# EasyEDA Pro project motor_driver.eprj

# Schematic Schematic1

## Sheets
1 P1: Create Date: 2024-08-04; Page Name: P1; Project Name: motor_driver; Schematic Name: Schematic1; Update Date: 2024-08-15; Company: 嘉立创EDA; Page Size: A4; Version: V1.0
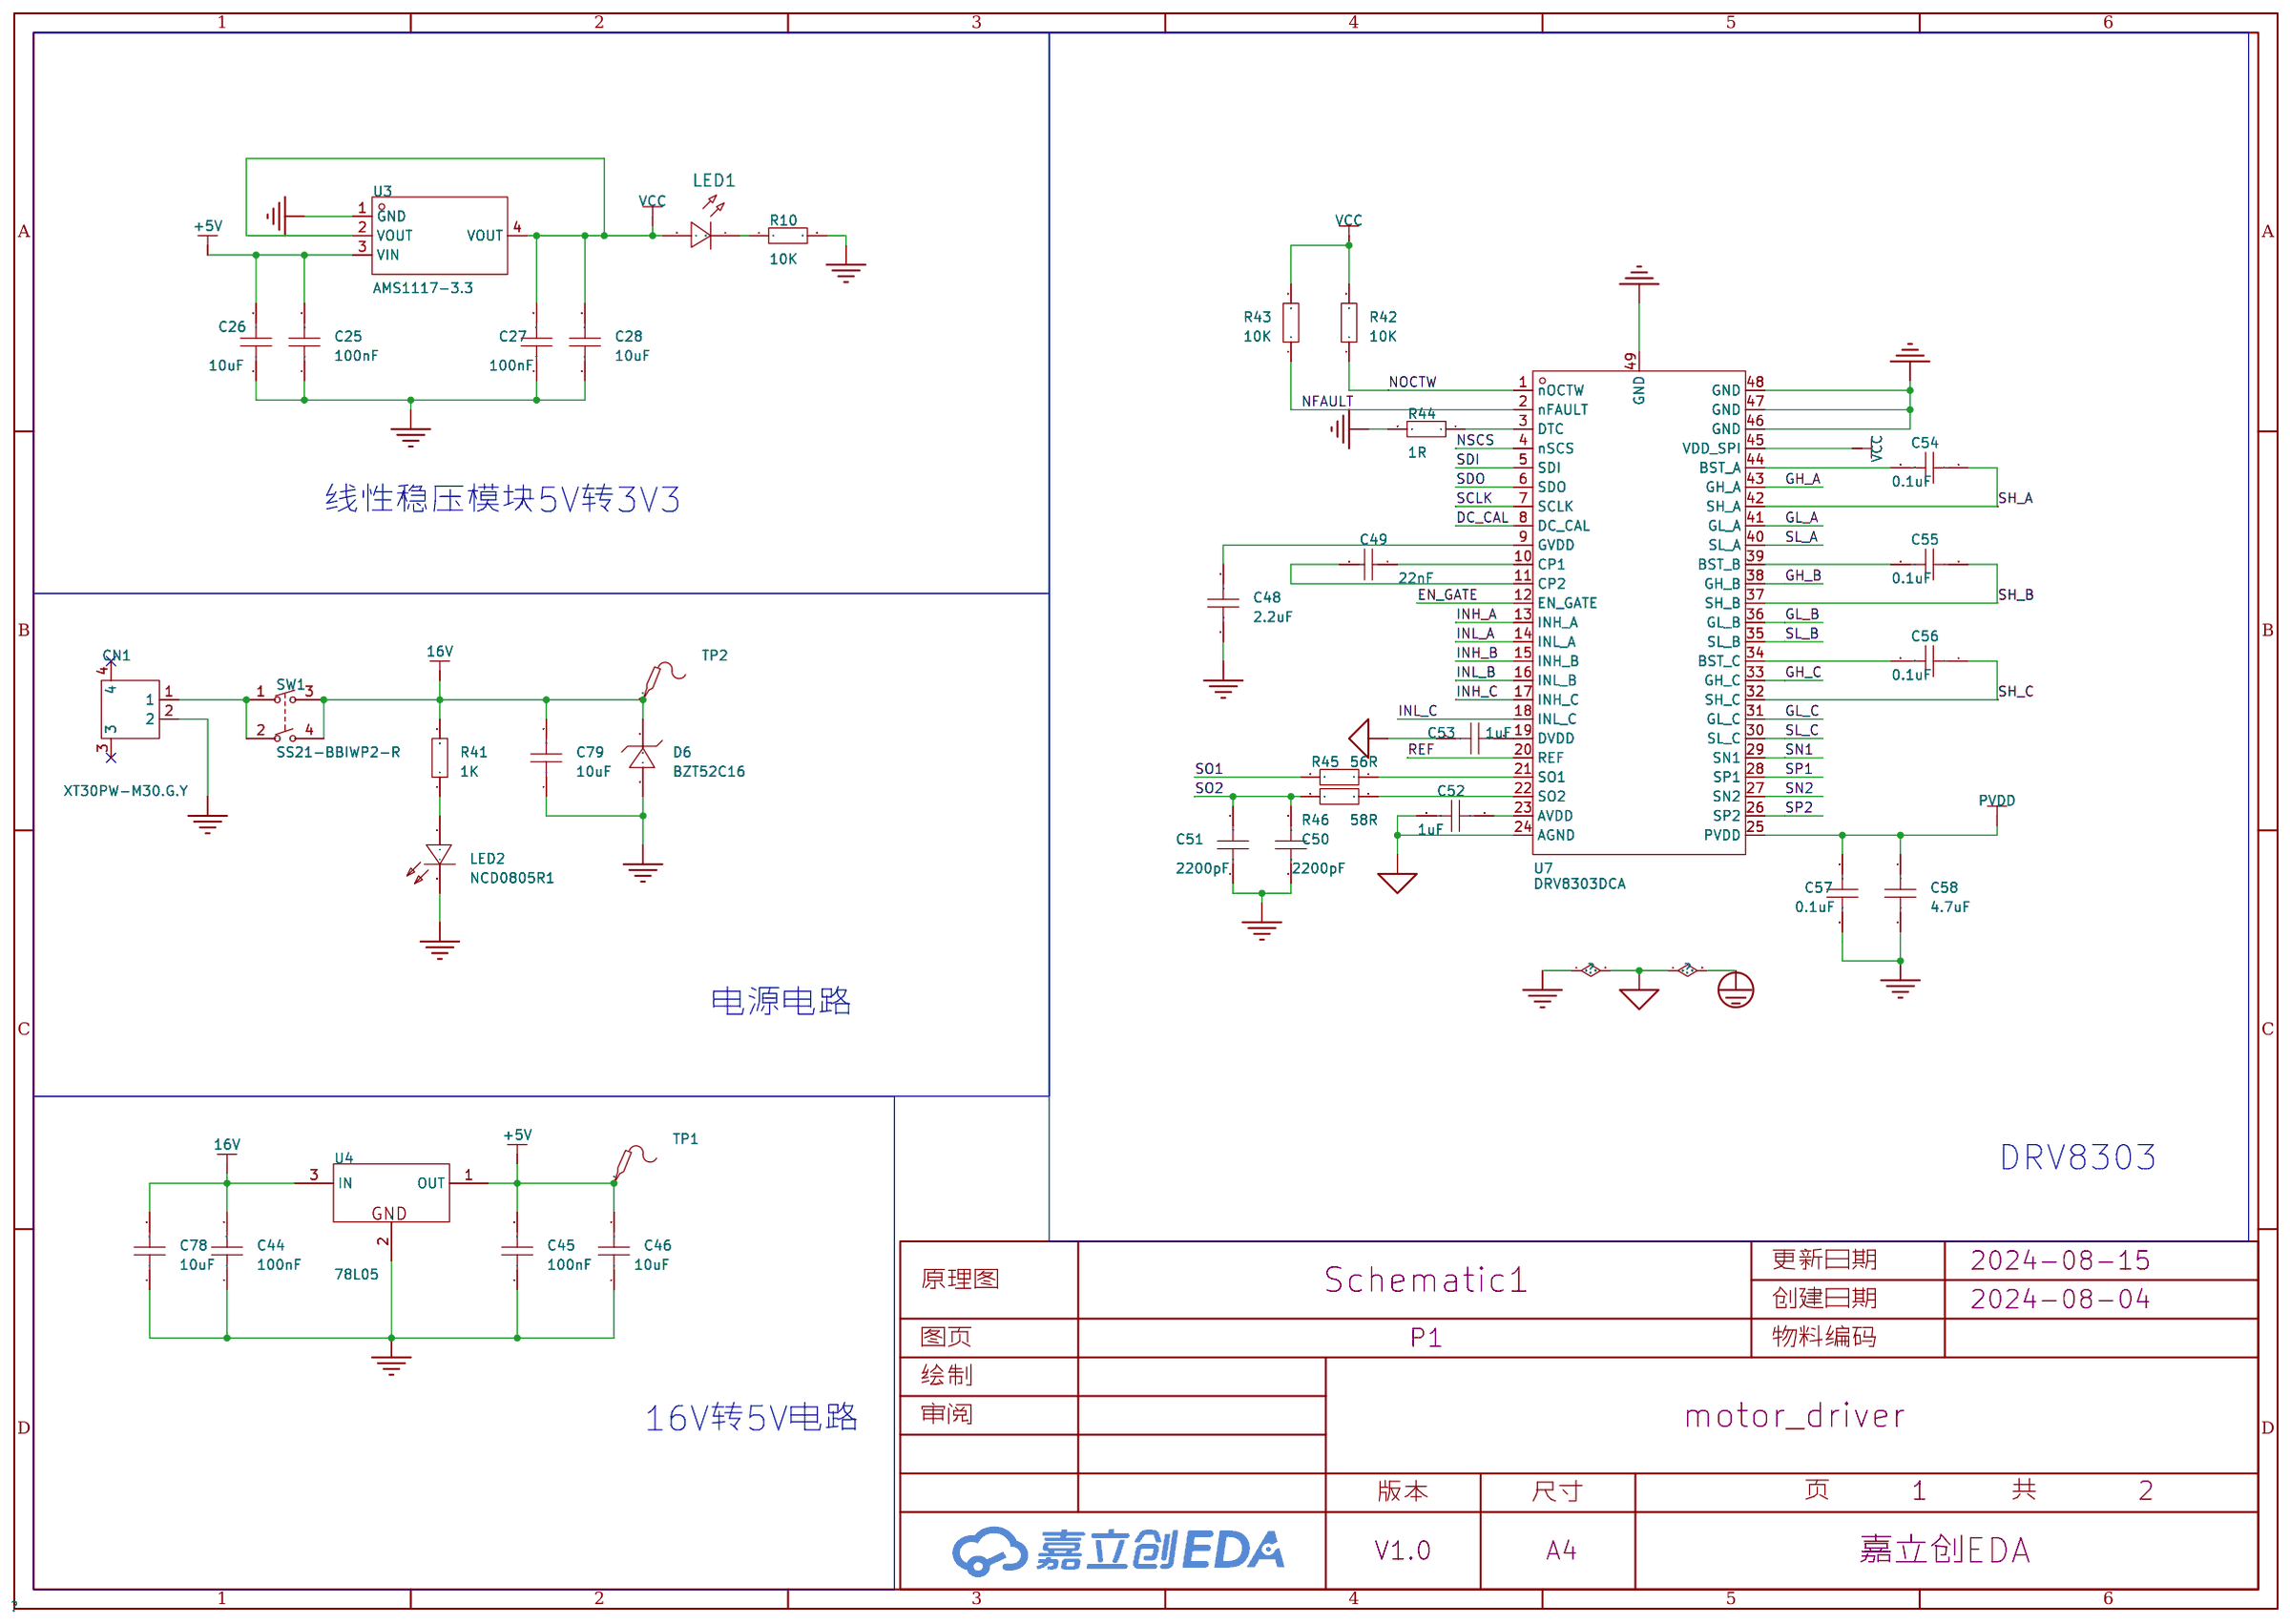
[diagram p0: P1]
2 P2: Page Name: P2; Update Date: 2024-08-27
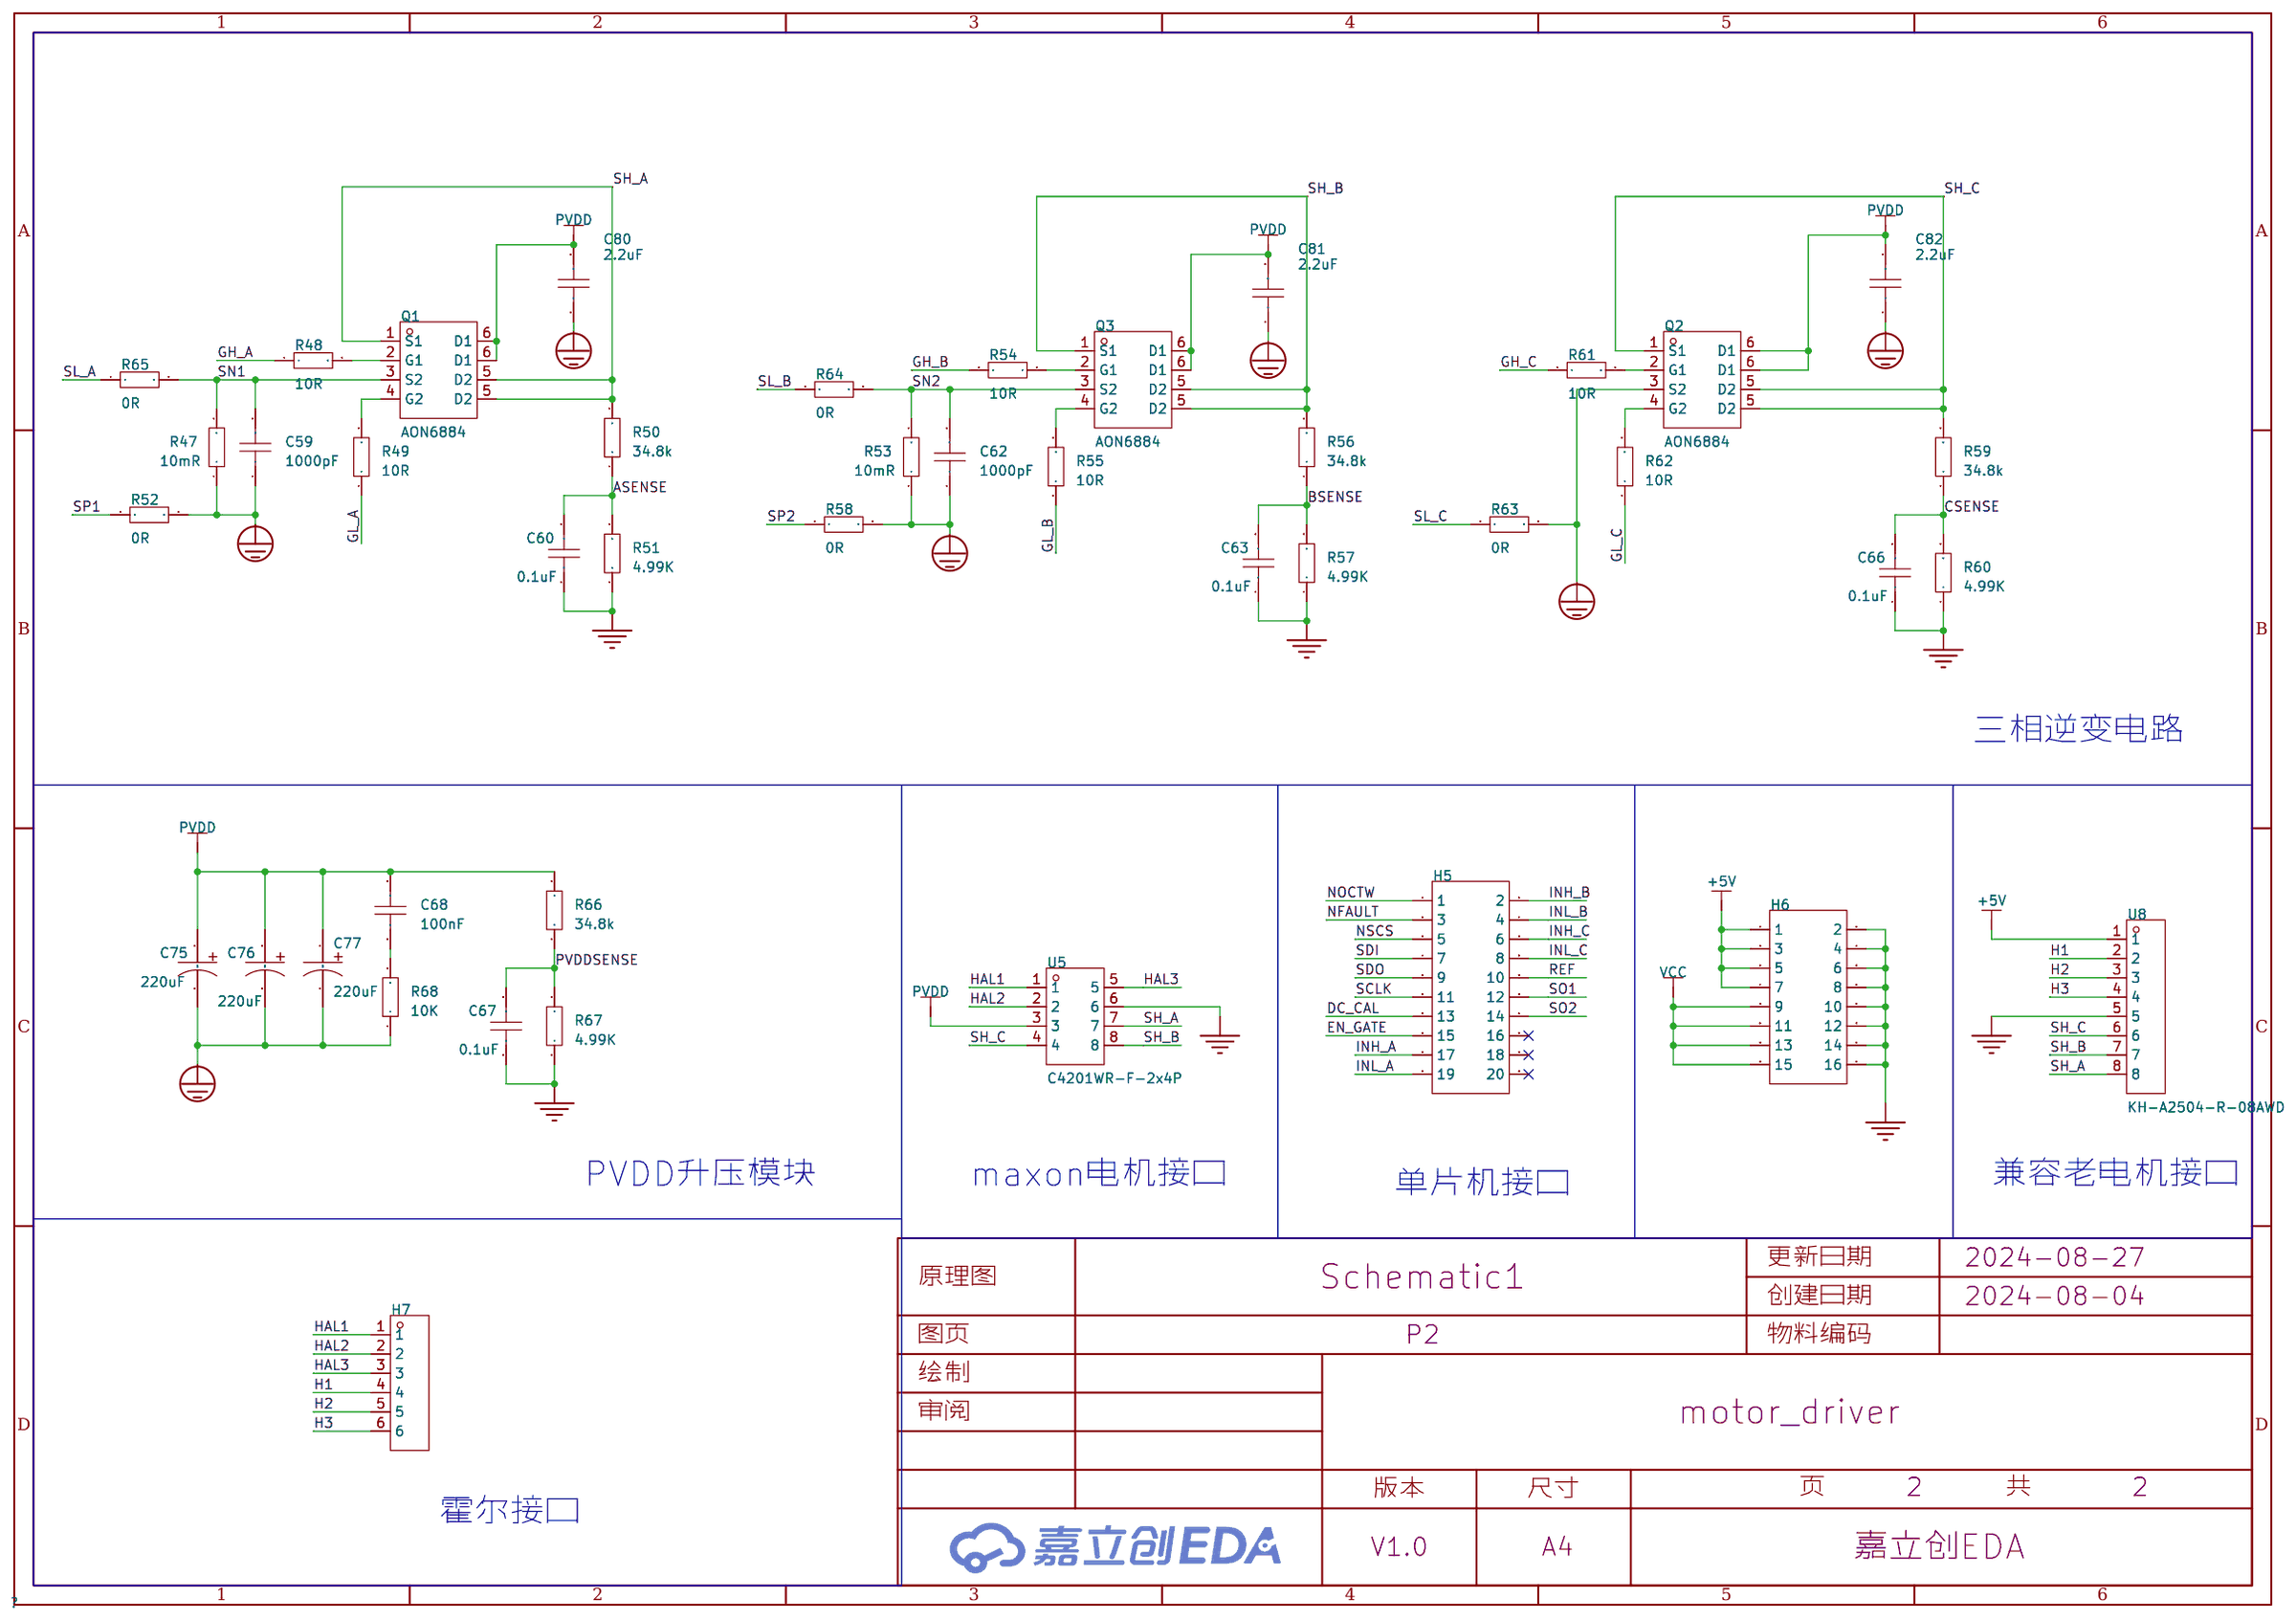
[diagram p1: P2]

## Parts
sheet P1
C25  100nF  [C0805]
C26  10uF  [C0805]
C27  100nF  [C0805]
C28  10uF  [C0805]
C44  100nF  [C0805]
C45  100nF  [C0805]
C46  10uF  [C0805]
C48  2.2uF  [C0805]
C49  22nF  [C0603]
C50  2200pF  [C0805]
C51  2200pF  [C0805]
C52  1uF  [C0805]
C53  1uF  [C0805]
C54  0.1uF  [C0805]
C55  0.1uF  [C0805]
C56  0.1uF  [C0805]
C57  0.1uF  [C0805]
C58  4.7uF  [C0805]
C78  10uF  [C0805]
C79  10uF  [C0805]
CN1  XT30PW-M30.G.Y  [CONN-TH_XT30PW-M]
D6  BZT52C16  [SOD-123_L2.7-W1.6-LS3.7-RD]
LED1  -  [LED_0805]
LED2  NCD0805R1  [LED0805-R-RD]
R10  10K  [R0805]
R41  1K  [R0603]
R42  10K  [R0603]
R43  10K  [R0603]
R44  1R  [R0603]
R45  56R  [R0603]
R46  58R  [R0603]
SW1  SS21-BBIWP2-R  [SW-TH_SS21-BBIWP2]
TP1  -  [Test-Point-0.5mm]
TP2  -  [Test-Point-0.5mm]
U3  AMS1117-3.3  [SOT-223-3_L6.5-W3.4-P2.30-LS7.0-BR]
U4  78L05  [SOT-89-3_L4.5-W2.5-P1.50-LS4.2-BR]
U7  DRV8303DCA  [HTSSOP-48_L12.5-W6.1-P0.50-LS8.1-BL-EP4.4]
sheet P2
C59  1000pF  [C0805]
C60  0.1uF  [C0603]
C62  1000pF  [C0805]
C63  0.1uF  [C0603]
C66  0.1uF  [C0603]
C67  0.1uF  [C0603]
C68  100nF  [C0805]
C75  220uF  [CAP-SMD_BD8.0-L8.3-W8.3-FD]
C76  220uF  [CAP-SMD_BD8.0-L8.3-W8.3-FD]
C77  220uF  [CAP-SMD_BD8.0-L8.3-W8.3-FD]
C80  2.2uF  [C0805]
C81  2.2uF  [C0805]
C82  2.2uF  [C0805]
H5  -  [HDR-TH_20P-P2.54-V-R2-C10-S2.54]
H6  -  [HDR-TH_16P-P2.54-V-F-R2-C8-S2.54-1]
H7  -  [HDR-TH_6P-P2.54-V-F]
Q1  AON6884  [DFN-8_L5.5-W5.2-P1.27-LS6.0-BL-EP2]
Q2  AON6884  [DFN-8_L5.5-W5.2-P1.27-LS6.0-BL-EP2]
Q3  AON6884  [DFN-8_L5.5-W5.2-P1.27-LS6.0-BL-EP2]
R47  10mR  [R0603]
R48  10R  [R0603]
R49  10R  [R0603]
R50  34.8k  [R0603]
R51  4.99K  [R0603]
R52  0R  [R0603]
R53  10mR  [R0603]
R54  10R  [R0603]
R55  10R  [R0603]
R56  34.8k  [R0603]
R57  4.99K  [R0603]
R58  0R  [R0603]
R59  34.8k  [R0603]
R60  4.99K  [R0603]
R61  10R  [R0603]
R62  10R  [R0603]
R63  0R  [R0603]
R64  0R  [R0603]
R65  0R  [R0603]
R66  34.8k  [R0603]
R67  4.99K  [R0603]
R68  10K  [R0603]
U5  C4201WR-F-2x4P  [CONN-TH_C4201WR-F-2X4P]
U8  KH-A2504-R-08AWD  [CONN-TH_8P-P2.50_KH-A2504-R-08AWD]

## Library data of the parts
C25-C28 C44-C46 C48 C50-C59 C62 C68 = CAP_0805: Supplier Footprint: 0805
C49 = CL10B223KB8NNNC: 容值:22nF;精度:±10%;额定电压:50V;材质(温度系数):X7R;; LCSC Part Name: 22nF ±10% 50V; Supplier Part: C21122; Manufacturer: SAMSUNG(三星); Supplier Footprint: 0603; JLCPCB Part Class: 基础库; Datasheet: https://atta.szlcsc.com/upload/public/pdf/source/20160218/1457707763339.pdf; Supplier: LCSC; Tolerance: ±10%; Voltage Rated: 50V; Temperature Coefficient: X7R
C78 C79 = CL21A106KAYNNNE_C15850: 容值:10uF;精度:±10%;额定电压:25V;材质(温度系数):X5R;; LCSC Part Name: 10uF ±10% 25V; Supplier Part: C15850; Manufacturer: SAMSUNG(三星); Manufacturer Part: CL21A106KAYNNNE; Supplier Footprint: 0805; JLCPCB Part Class: 基础库; Datasheet: https://atta.szlcsc.com/upload/public/pdf/source/20160218/1457707763339.pdf; Supplier: LCSC; Tolerance: ±10%; Voltage Rated: 25V; Temperature Coefficient: X5R
CN1 = XT30PW-M30.G.Y: 类别:-;类型1:-;; LCSC Part Name: AMASS(艾迈斯)航模插头 卧式弯脚 XT30PW-M公头; Supplier Part: C431092; Manufacturer: AMASS(艾迈斯); JLCPCB Part Class: Extended Part; Datasheet: https://atta.szlcsc.com/upload/public/pdf/source/20220222/6A9F22F7850E25B33E1BE430ADF8560B.pdf; Supplier: LCSC; Type: 航模插头; RatedVoltage: DC 500V; InterfaceType: 公头; RatedCurrent: 15A; RecommendedWireGauge: 16/18/20AWG; contact resistance: 1.2mΩ; specifications: 2pin
D6 = BZT52C16_C216724: 二极管配置:独立式;稳压值(标称值):16V;稳压值(范围):15.3V~17.1V;功率:500mW;精度:±5%;; Supplier Part: C216724; Manufacturer: SHIKUES(时科); Supplier Footprint: SOD-123; JLCPCB Part Class: 扩展库; Datasheet: https://atta.szlcsc.com/upload/public/pdf/source/20180521/C216736_0F7817A5B0D519AB82EE72E876335F07.pdf; Supplier: LCSC; Diode Configuration: 独立式; Zener Voltage (Nom): 16V; Reverse Leakage Current (Ir): 100nA@12V; Zener Voltage (Range): 15.3V~17.1V; Power Dissipation: 500mW; Zener Impedance (Zzt): 40Ω; Tolerance: ±5%
LED1 = LED_0805-R: Supplier Footprint: 0805
LED2 = NCD0805R1: 灯头类型:-;发光颜色:红色;正向电压(VF):1.6V~2.6V;功率:65mW;正向电流:20mA;主波长:615nm~630nm;二极管配置:独立二极管;透镜颜色:无色透明透镜;色温:-;发光强度:67mcd~195mcd;发光角度:130°;载带方式:-;工作温度:-30℃~+85℃;; Supplier Part: C84256; Manufacturer: 国星光电; Supplier Footprint: 0805; JLCPCB Part Class: 基础库; Datasheet: https://atta.szlcsc.com/upload/public/pdf/source/20200820/C84256_F0A75A43B3EAD75808600A0514C76B99.pdf; Supplier: LCSC; Emitted Color: 红色; Forward Voltage (VF): 1.6V~2.6V; Power Dissipation: 65mW; Forward Current: 20mA; Dominant Wavelength: 615nm~630nm; Diode Configuration: 独立二极管; Lens Color: 无色透明透镜; Luminous Intensity: 67mcd~195mcd; Viewing Angle: 130°; Operating Temperature: -30℃~+85℃
R10 = Res_0805: Supplier Footprint: 0805
R41-R68 = Res_0603: Supplier Footprint: 0603
SW1 = SS21-BBIWP2-R: 带灯:-;引脚样式:焊片;额定电流:10A;额定电压(AC):250V;额定电压(DC):-;电路结构:双刀单掷;机械寿命:-;; LCSC Part Name: 跷板开关DPST 15x21mm; Supplier Part: C309182; Manufacturer: Legion(六钧); Supplier Footprint: 插件; JLCPCB Part Class: 扩展库; Datasheet: https://atta.szlcsc.com/upload/public/pdf/source/20190311/C309182_BE3155CDE2291F8D537E9264D9294CC5.pdf; Supplier: LCSC; Actuator Type: 凹面弯曲; Pin Style: 焊片; Actuator Color: 黑色; Contact Current: 10A; Voltage Rating (AC): 250V; Circuit: 双刀单掷; Actuator Identifier: - O
TP1 TP2 = Test-Point: Test Point 测试点
U3 = AMS1117-3.3_C6186: 输出类型:固定;最大输入电压:-;输出电压:3.3V;最大输出电流:1A;电源纹波抑制比(PSRR):72dB@(120Hz);输出极性:正极;; LCSC Part Name: 输出3.3V 1A; Supplier Part: C6186; Manufacturer: AMS; Supplier Footprint: SOT-223; JLCPCB Part Class: 基础库; Datasheet: https://atta.szlcsc.com/upload/public/pdf/source/20180727/C6186_7A095716F0823C02F1997A905E26C086.pdf; Supplier: LCSC; Output Type: 固定; Output Voltage: 3.3V; MAX Output Current: 1A; Power Supply Rejection Ratio (PSRR): 72dB@(120Hz); Dropout Voltage: 1.3V@(800mA); Output Polarity: 正极; Number of Outputs: 1
U4 = 78L05_C347258: 输出类型:固定;最大输入电压:30V;输出电压:5V;最大输出电流:100mA;电源纹波抑制比(PSRR):49dB@(120Hz);输出极性:正极;; LCSC Part Name: 输入30V 输出5V 100mA; Supplier Part: C347258; Manufacturer: UMW(友台半导体); Supplier Footprint: SOT-89-3; JLCPCB Part Class: 扩展库; Datasheet: https://atta.szlcsc.com/upload/public/pdf/source/20231109/E3DE607B64FB2BED1580456949804217.pdf; Supplier: LCSC; Output Type: 固定; Maximum Input Voltage: 30V; Output Voltage: 5V; MAX Output Current: 100mA; Power Supply Rejection Ratio (PSRR): 49dB@(120Hz); Dropout Voltage: 1.7V@(40mA); standby current: 5.5mA; Operating Temperature: -20℃~+120℃@(Tj); Output Polarity: 正极; Number of Outputs: 1
U7 = DRV8303DCA: DRV8303 具有电流分流放大器和 SPI 的最大 65V 三相栅极驱动器; LCSC Part Name: 无刷直流BLDC电机驱动芯片 60V; Supplier Part: C1523892; Manufacturer: TI(德州仪器); Supplier Footprint: HTSSOP-48-EP-6.1mm; JLCPCB Part Class: 扩展库; Datasheet: https://www.ti.com/cn/lit/gpn/drv8303; Supplier: LCSC
C60 C63 C66 C67 = CAP_0603: Supplier Footprint: 0603
C75-C77 = 20SVPK220M: 容值:220uF;精度:±20%;额定电压:20V;纹波电流:1.01A@100kHz;等效串联电阻:25mΩ@100kHz~300kHz;类型:聚合物;; LCSC Part Name: 220uF ±20% 20V; Supplier Part: C454650; Manufacturer: PANASONIC(松下); Supplier Footprint: SMD,D8xL6.9mm; JLCPCB Part Class: 扩展库; Supplier: LCSC; Tolerance: ±20%; Rated Voltage: 20V; Ripple Current: 1.01A@100kHz; Equivalent Series Resistance(ESR): 25mΩ@100kHz~300kHz; Type: 聚合物; φD: 8mm; L: 6.9mm; Lifetime @ Temp: 100hrs@125℃; Operating Temperature: -55℃~+125℃
C80-C82 = CL21A225KBQNNNE: 容值:2.2uF;精度:±10%;额定电压:50V;材质(温度系数):X5R;; LCSC Part Name: 2.2uF ±10% 50V; Supplier Part: C377773; Manufacturer: SAMSUNG(三星); Supplier Footprint: 0805; JLCPCB Part Class: 基础库; Datasheet: https://atta.szlcsc.com/upload/public/pdf/source/20160218/1457707763339.pdf; Supplier: LCSC; Tolerance: ±10%; Voltage Rated: 50V; Temperature Coefficient: X5R
H5 = HDR-F_2.54_2x10: Supplier Part: C30867; Supplier Footprint: 插件
H6 = HDR-F_2.54_2x8: Supplier Part: C30734; Supplier Footprint: 插件
H7 = HDR-F_2.54_1x6P: Supplier Part: C40877; Supplier Footprint: 插件
Q1-Q3 = AON6884: 类型:2个N沟道;漏源电压(Vdss):40V;连续漏极电流(Id):9A;功率(Pd):1.6W;导通电阻(RDS(on)@Vgs,Id):11.3mΩ@10V,10A;阈值电压(Vgs(th)@Id):2.7V@250uA;; LCSC Part Name: 2个N沟道 耐压:40V 电流:9A; Supplier Part: C125872; Manufacturer: AOS; Supplier Footprint: DFN-8(5.2x5.5); JLCPCB Part Class: 扩展库; Datasheet: https://atta.szlcsc.com/upload/public/pdf/source/20180326/C125872_34AF0DD57D8DED273B86A053347F87CE.pdf; Supplier: LCSC; Type: 2个N沟道; Drain Source Voltage (Vdss): 40V; Continuous Drain Current (Id): 9A; Power Dissipation (Pd): 1.6W; Drain Source On Resistance (RDS(on)@Vgs,Id): 11.3mΩ@10V,10A; Gate Threshold Voltage (Vgs(th)@Id): 2.7V@250uA
U5 = C4201WR-F-2x4P_C5333426: Supplier Part: C5333426; Manufacturer: CJT(长江连接器); Supplier Footprint: 弯插,P=4.2mm; JLCPCB Part Class: 扩展库; Datasheet: https://atta.szlcsc.com/upload/public/pdf/source/20210326/C2764355_A41BE8F3AF9C3DD861E3A84F228C93DC.pdf; Supplier: LCSC
U8 = KH-A2504-R-08AWD: 插针结构:1x8P;间距:2.54mm;安装方式:弯插;总PIN数:8P;排数:1;每排PIN数:8;; LCSC Part Name: 间距:2.54mm 1x8P 白色; Supplier Part: C18186422; Manufacturer: kinghelm(金航标); Supplier Footprint: 插件,P=2.5mm; JLCPCB Part Class: 扩展库; Datasheet: https://atta.szlcsc.com/upload/public/pdf/source/20230919/6D15C2409625FC46455D302EA5C53430.pdf; Supplier: LCSC; Pins Structure: 1x8P; Pitch: 2.54mm; Mounting Style: 弯插; Number of Pins: 8P; Number of Rows: 1; Number of PINs Per Row: 8

## Nets
16V: C44.2 C78.2 C79.2 D6.1(K) R41.2 SW1.3 SW1.4 TP2.1 U4.3(IN)
+5V: C25.2 C26.2 C45.2 C46.2 H6.1 H6.3 H6.5 H6.7 TP1.1 U3.3(VIN) U4.1(OUT) U8.1
AGND: C25.1 C26.1 C27.1 C28.1 C44.1 C45.1 C46.1 C48.1 C50.1 C51.1 C52.2 C53.2 C57.2 C58.2 C59.1 C60.1 C62.1 C63.1 C66.1 C67.1 C75.2 C76.2 C77.2 C78.1 C79.1 C80.1 C81.1 C82.1 CN1.2 D6.2(A) H6.2 H6.4 H6.6 H6.8 H6.10 H6.12 H6.14 H6.16 LED2.2(-) Q2.3(S2) R10.2 R44.2 R47.1 R51.1 R52.2 R53.1 R57.1 R58.2 R60.1 R63.2 R67.1 R68.1 U3.1(GND) U4.2(GND) U5.6 U7.24(AGND) U7.46(GND) U7.47(GND) U7.48(GND) U7.49(GND) U8.5
PVDD: C57.1 C58.1 C68.2 C75.1 C76.1 C77.1 C80.2 C81.2 C82.2 Q1.6(D1) Q2.6(D1) Q3.6(D1) R66.2 U5.3 U7.25(PVDD)
PVDDSENSE: C67.2 R66.1 R67.2
VCC: C27.2 C28.2 H6.9 H6.11 H6.13 H6.15 LED1.2(A) R42.2 R43.2 U3.2(VOUT) U3.4(VOUT) U7.45(VDD_SPI)
ASENSE: C60.2 R50.1 R51.2
BSENSE: C63.2 R56.1 R57.2
CSENSE: C66.2 R59.1 R60.2
DC_CAL: H5.13 U7.8(DC_CAL)
EN_GATE: H5.15 U7.12(EN_GATE)
GH_A: R48.1 U7.43(GH_A)
GH_B: R54.1 U7.38(GH_B)
GH_C: R61.1 U7.33(GH_C)
GL_A: R49.1 U7.41(GL_A)
GL_B: R55.1 U7.36(GL_B)
GL_C: R62.1 U7.31(GL_C)
H1: H7.4 U8.2
H2: H7.5 U8.3
H3: H7.6 U8.4
HAL1: H7.1 U5.1
HAL2: H7.2 U5.2
HAL3: H7.3 U5.5
INH_A: H5.17 U7.13(INH_A)
INH_B: H5.2 U7.15(INH_B)
INH_C: H5.6 U7.17(INH_C)
INL_A: H5.19 U7.14(INL_A)
INL_B: H5.4 U7.16(INL_B)
INL_C: H5.8 U7.18(INL_C)
NFAULT: H5.3 R43.1 U7.2(nFAULT)
NOCTW: H5.1 R42.1 U7.1(nOCTW)
NSCS: H5.5 U7.4(nSCS)
REF: H5.10 U7.20(REF)
SCLK: H5.11 U7.7(SCLK)
SDI: H5.7 U7.5(SDI)
SDO: H5.9 U7.6(SDO)
SH_A: C54.1 Q1.1(S1) Q1.5(D2) R50.2 U5.7 U7.42(SH_A) U8.8
SH_B: C55.1 Q3.1(S1) Q3.5(D2) R56.2 U5.8 U7.37(SH_B) U8.7
SH_C: C56.1 Q2.1(S1) Q2.5(D2) R59.2 U5.4 U7.32(SH_C) U8.6
SL_A: R65.1 U7.40(SL_A)
SL_B: R64.1 U7.35(SL_B)
SL_C: R63.1 U7.30(SL_C)
SN1: C59.2 Q1.3(S2) R47.2 R65.2 U7.29(SN1)
SN2: C62.2 Q3.3(S2) R53.2 R64.2 U7.27(SN2)
SO1: H5.12 R45.2
SO2: C50.2 C51.2 H5.14 R46.2
SP1: R52.1 U7.28(SP1)
SP2: R58.1 U7.26(SP2)
$3N286: LED1.1(C) R10.1
$3N603: CN1.1 SW1.1 SW1.2
$3N605: LED2.1(+) R41.1
$3N1469: R44.1 U7.3(DTC)
$3N1546: C48.2 U7.9(GVDD)
$3N1634: C49.1 U7.10(CP1)
$3N1637: C49.2 U7.11(CP2)
$3N1642: R45.1 U7.21(SO1)
$3N1645: R46.1 U7.22(SO2)
$3N1837: C52.1 U7.23(AVDD)
$3N1907: C53.1 U7.19(DVDD)
$3N2117: C54.2 U7.44(BST_A)
$3N2227: C56.2 U7.34(BST_C)
$3N2233: C55.2 U7.39(BST_B)
$4N615: Q1.2(G1) R48.2
$4N618: Q1.4(G2) R49.2
$4N1413: Q3.2(G1) R54.2
$4N1415: Q3.4(G2) R55.2
$4N1749: Q2.2(G1) R61.2
$4N1755: Q2.4(G2) R62.2
$4N2179: C68.1 R68.2

Not connected (* = marked no-connect by the designer): CN1 3* 4*; H5 16* 18* 20*

## Notes on the sheets
sheet 1
- 线性稳压模块5V转3V3
- 电源电路
- DRV8303
- 16V转5V电路
sheet 2
- 三相逆变电路
- PVDD升压模块
- maxon电机接口
- 单片机接口
- 兼容老电机接口
- 霍尔接口

# Board PCB1
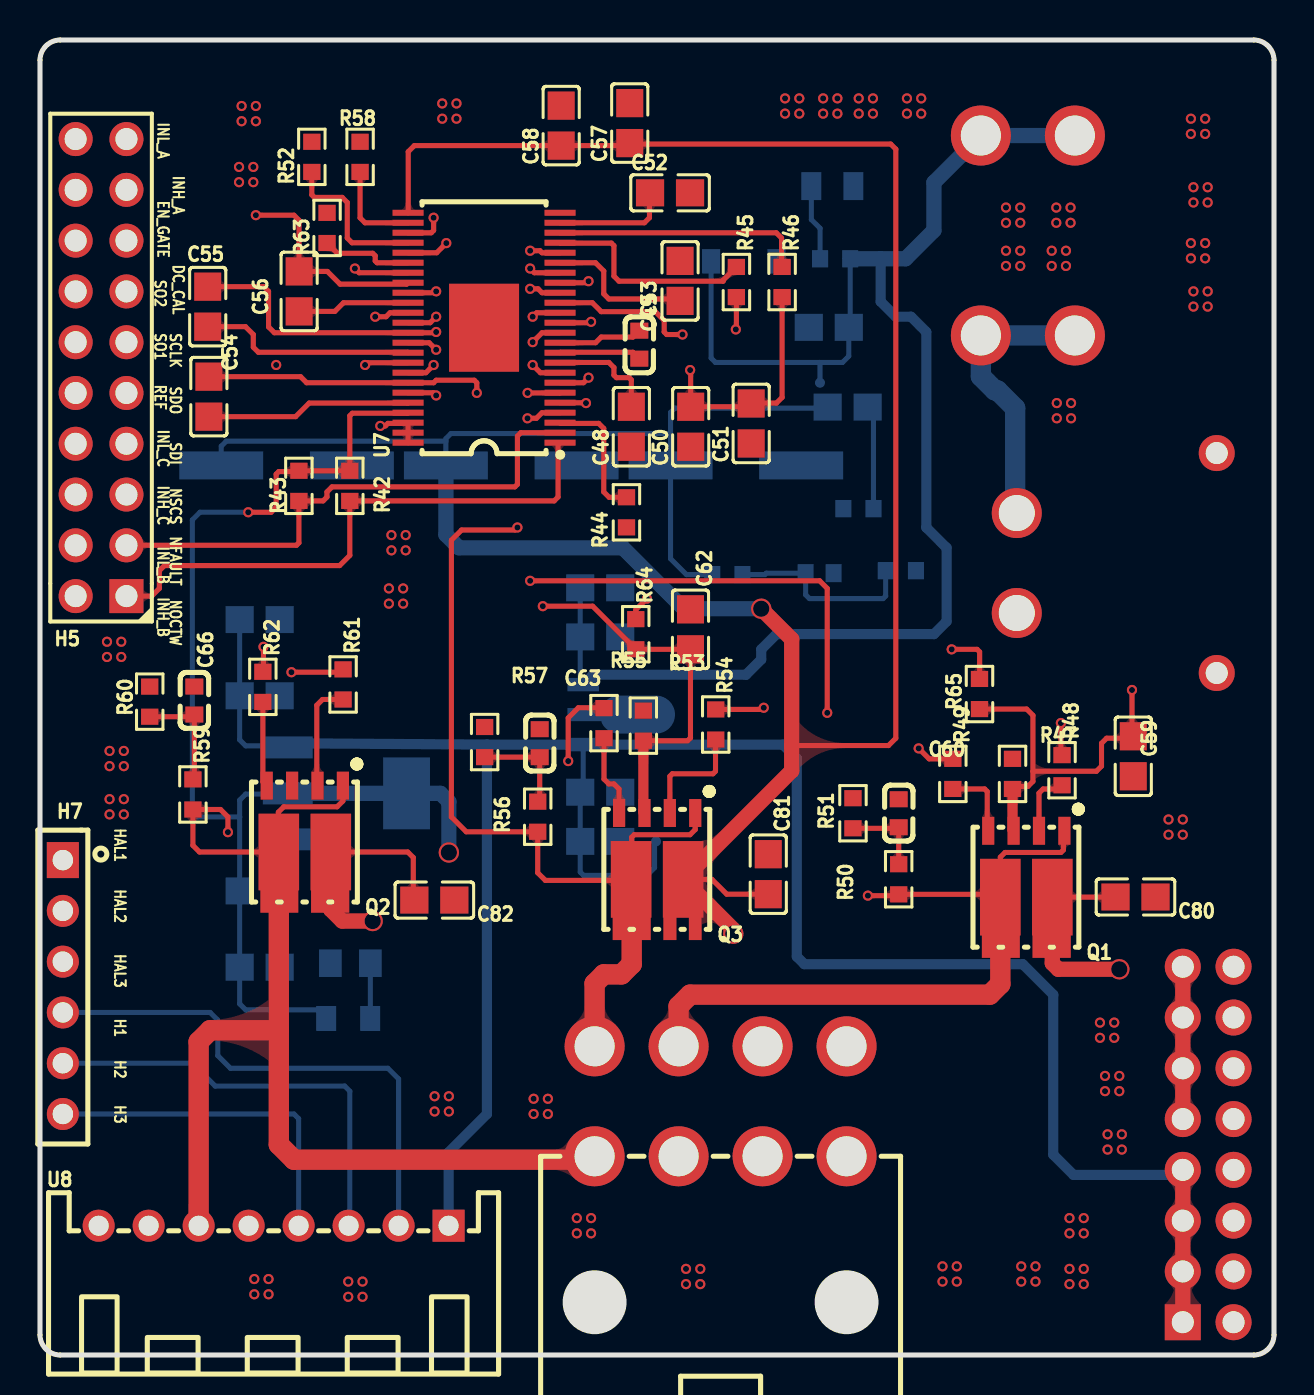
[diagram p2: board, top side]
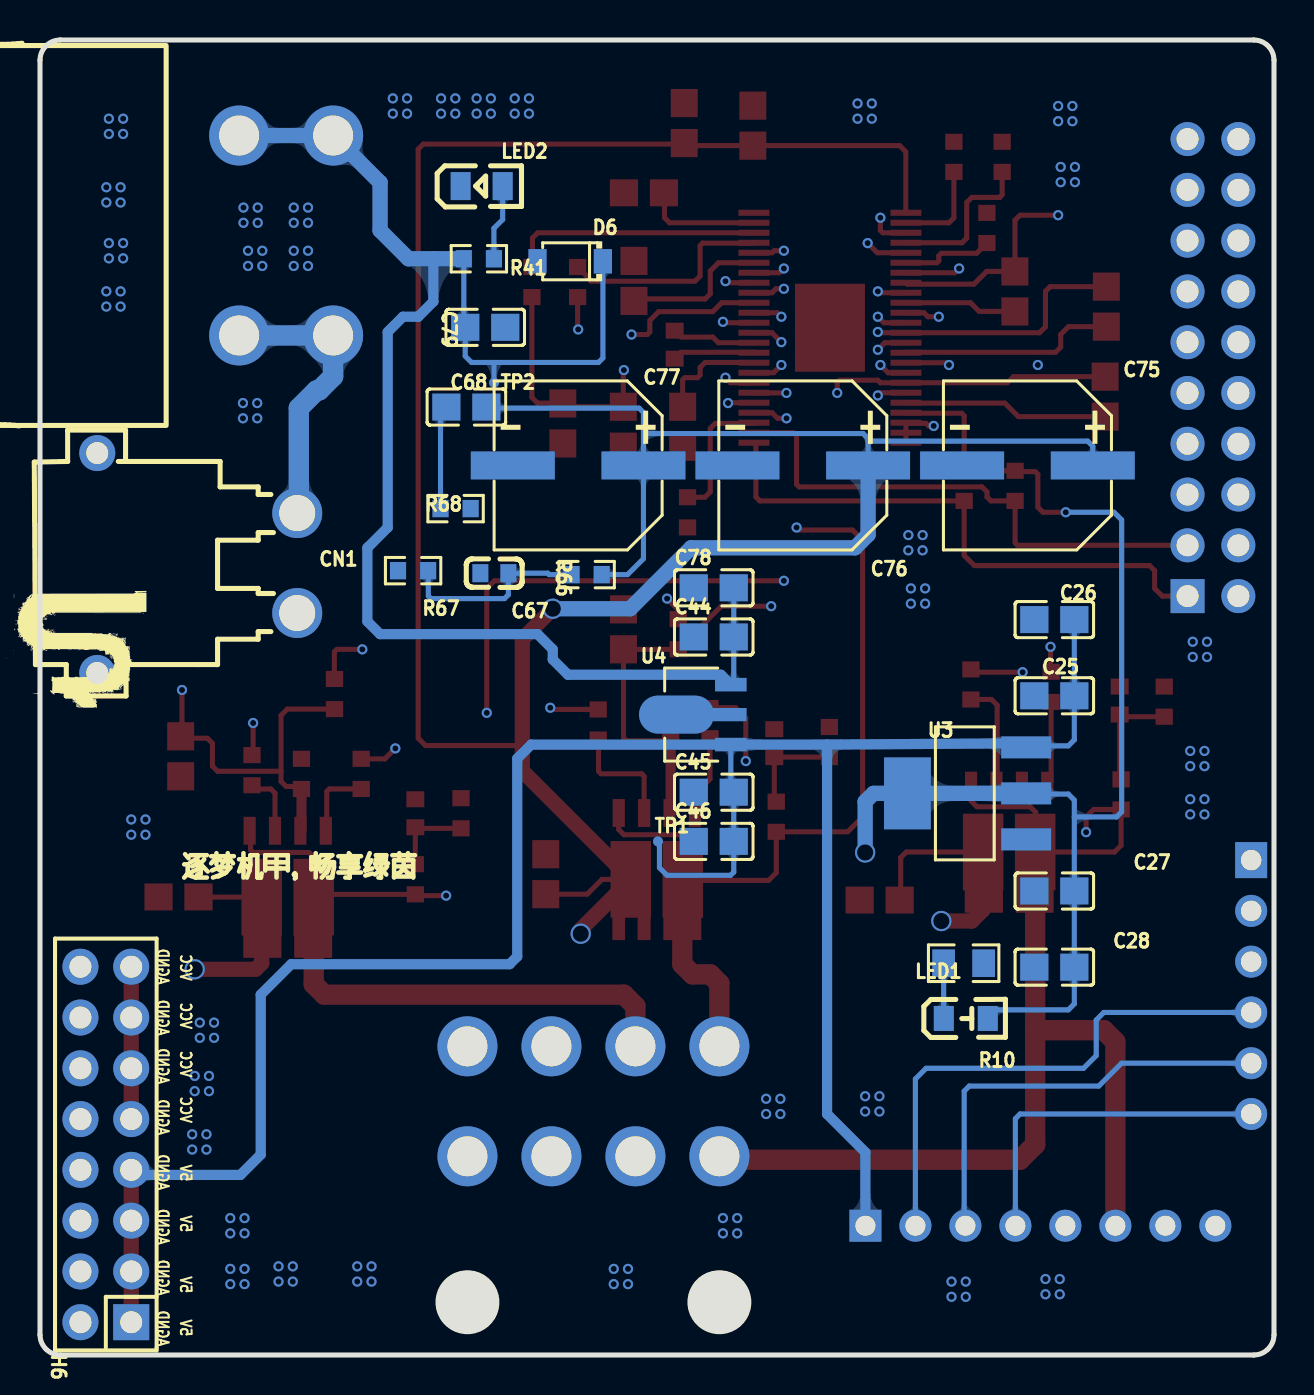
[diagram p3: board, bottom side, seen from below]

Outline 61.71 x 65.78 mm; copper layers: Top Layer, Inner1, Inner2, Inner3, Inner4, Bottom Layer. Coordinates in mm from the lower left corner of the outline.
Outline path: 0,64.76 0,1.02 arc(0.3,0.3) 1.02,0 60.7,0 arc(61.41,0.3) 61.71,1.02 61.71,64.76 arc(61.41,65.48) 60.7,65.78 1.02,65.78 arc(0.3,65.48) 0,64.76
Stack: Top Layer 0.035mm 外层铜厚1oz / Dielectric1 0.0994mm 3313 RC57% 4.2mil / Inner1 0.0152mm 内层铜厚 / Dielectric2 0.55mm 0.55mm H/H不含铜 / Inner2 0.0152mm 内层铜厚 / Dielectric3 0.1088mm 2116 RC54% 4.9mil / Inner3 0.0152mm 内层铜厚 / Dielectric4 0.55mm 0.55mm H/H不含铜 / Inner4 0.0152mm 内层铜厚 / Dielectric5 0.0994mm 3313 RC57% 4.2mil / Bottom Layer 0.035mm 外层铜厚1oz

## Design rules (mm)
template: 自定义配置
spacing copperThickness1oz (default): track to track 0.102, other pairs 0.152 to 0.3
spacing copperThickness2oz: track to track 0.203, other pairs 0.152 to 0.3
track width copperThickness1oz (default): min 0.127, default 0.254, max 2.54
track width copperThickness2oz: min 0.203, default 0.254, max 2.54
differential pair differentialPair (default): width min 0.127, default 0.254, max 2.54; gap min 0.152, default 0.152
via viaSize (default): diameter min 0.5, default 0.61, max 10; hole min 0.3, default 0.305, max 6.3

## Placement (name value [footprint] x y rotation side)
C25  100nF  [C0805]  10.99 32.97 180 bottom
C26  10uF  [C0805]  10.99 36.78 180 bottom
C27  100nF  [C0805]  10.99 23.21 180 bottom
C28  10uF  [C0805]  10.99 19.4 180 bottom
C44  100nF  [C0805]  28.02 35.91 180 bottom
C45  100nF  [C0805]  28.02 28.15 180 bottom
C46  10uF  [C0805]  28.02 25.69 180 bottom
C48  2.2uF  [C0805]  29.57 46.43 90 top
C49  22nF  [C0603]  29.97 50.54 90 top
C50  2200pF  [C0805]  32.54 46.43 90 top
C51  2200pF  [C0805]  35.57 46.6 90 top
C52  1uF  [C0805]  31.51 58.13 0 top
C53  1uF  [C0805]  32.01 53.73 90 top
C54  0.1uF  [C0805]  8.44 47.94 270 top
C55  0.1uF  [C0805]  8.39 52.44 270 top
C56  0.1uF  [C0805]  12.96 53.2 270 top
C57  0.1uF  [C0805]  29.49 61.62 90 top
C58  4.7uF  [C0805]  26.06 61.49 90 top
C59  1000pF  [C0805]  54.67 29.95 90 top
C60  0.1uF  [C0603]  42.94 27.1 270 top
C62  1000pF  [C0805]  32.53 36.3 270 top
C63  0.1uF  [C0603]  24.99 30.6 270 top
C66  0.1uF  [C0603]  7.72 32.74 270 top
C67  0.1uF  [C0603]  38.99 39.11 180 bottom
C68  100nF  [C0805]  40.39 47.42 180 bottom
C75  220uF  [CAP-SMD_BD8.0-L8.3-W8.3-FD]  12.33 44.5 0 bottom
C76  220uF  [CAP-SMD_BD8.0-L8.3-W8.3-FD]  23.57 44.5 0 bottom
C77  220uF  [CAP-SMD_BD8.0-L8.3-W8.3-FD]  34.8 44.5 0 bottom
C78  10uF  [C0805]  28.02 38.37 180 bottom
C79  10uF  [C0805]  39.45 51.4 0 bottom
C80  2.2uF  [C0805]  54.78 22.91 180 top
C81  2.2uF  [C0805]  36.42 24.05 270 top
C82  2.2uF  [C0805]  19.72 22.76 180 top
CN1  XT30PW-M30.G.Y  [CONN-TH_XT30PW-M]  53.85 39.61 270 bottom
D6  BZT52C16  [SOD-123_L2.7-W1.6-LS3.7-RD]  35.2 54.71 0 bottom
H5  -  [HDR-TH_20P-P2.54-V-R2-C10-S2.54]  3.05 49.39 90 top
H6  -  [HDR-TH_16P-P2.54-V-F-R2-C8-S2.54-1]  58.42 10.53 90 bottom
H7  -  [HDR-TH_6P-P2.54-V-F]  1.14 18.41 270 top
LED1  -  [LED_0805]  15.36 16.83 180 bottom
LED2  NCD0805R1  [LED0805-R-RD]  39.62 58.47 180 bottom
Q1  AON6884  [DFN-8_L5.5-W5.2-P1.27-LS6.0-BL-EP2]  49.32 24.56 180 top
Q2  AON6884  [DFN-8_L5.5-W5.2-P1.27-LS6.0-BL-EP2]  13.24 26.82 180 top
Q3  AON6884  [DFN-8_L5.5-W5.2-P1.27-LS6.0-BL-EP2]  30.86 25.45 180 top
R10  10K  [R0805]  15.52 19.6 180 bottom
R41  1K  [R0603]  39.76 54.83 0 bottom
R42  10K  [R0603]  15.49 43.47 90 top
R43  10K  [R0603]  12.95 43.47 90 top
R44  1R  [R0603]  29.33 42.15 270 top
R45  56R  [R0603]  34.83 53.67 270 top
R46  58R  [R0603]  37.11 53.67 270 top
R47  10mR  [R0603]  48.63 29.07 270 top
R48  10R  [R0603]  51.11 29.25 270 top
R49  10R  [R0603]  45.65 29.07 270 top
R50  34.8k  [R0603]  42.94 23.8 270 top
R51  4.99K  [R0603]  40.66 27.1 270 top
R52  0R  [R0603]  13.59 59.93 90 top
R53  10mR  [R0603]  30.17 31.48 270 top
R54  10R  [R0603]  33.79 31.54 270 top
R55  10R  [R0603]  28.21 31.61 270 top
R56  34.8k  [R0603]  24.89 26.92 270 top
R57  4.99K  [R0603]  22.24 30.66 270 top
R58  0R  [R0603]  16.01 59.93 90 top
R59  34.8k  [R0603]  7.65 28.04 270 top
R60  4.99K  [R0603]  5.49 32.68 270 top
R61  10R  [R0603]  15.16 33.54 270 top
R62  10R  [R0603]  11.15 33.42 270 top
R63  0R  [R0603]  14.36 56.37 90 top
R64  0R  [R0603]  29.79 36.05 270 top
R65  0R  [R0603]  46.98 33.06 270 top
R66  34.8k  [R0603]  34.37 39.03 180 bottom
R67  4.99K  [R0603]  43.05 39.23 180 bottom
R68  10K  [R0603]  40.93 42.34 0 bottom
SW1  SS21-BBIWP2-R  [SW-TH_SS21-BBIWP2]  49.4 56 90 bottom
TP1  -  [Test-Point-0.5mm]  30.81 25.69 180 bottom
TP2  -  [Test-Point-0.5mm]  39.01 48.63 0 bottom
U3  AMS1117-3.3  [SOT-223-3_L6.5-W3.4-P2.30-LS7.0-BR]  15.36 28.09 180 bottom
U4  78L05  [SOT-89-3_L4.5-W2.5-P1.50-LS4.2-BR]  28.52 32.03 180 bottom
U5  C4201WR-F-2x4P  [CONN-TH_C4201WR-F-2X4P]  34.04 12.69 180 top
U7  DRV8303DCA  [HTSSOP-48_L12.5-W6.1-P0.50-LS8.1-BL-EP4.4]  22.21 51.38 90 top
U8  KH-A2504-R-08AWD  [CONN-TH_8P-P2.50_KH-A2504-R-08AWD]  11.68 6.47 0 top

## Footprints (pads in the part's own frame, mm; a bottom-side part is the same pattern mirrored in y, then rotated)
C0603
  rect 0.8x0.9 smd: 1(-0.7,0) 2(0.7,0)
C0805
  rect 1.41x1.35 smd: 1(-1,0) 2(1,0)
CAP-SMD_BD8.0-L8.3-W8.3-FD
  rect 4.2x1.4 smd: 1(-3.267,0) 2(3.267,0)
CONN-TH_8P-P2.50_KH-A2504-R-08AWD
  rect 1.6x1.6 hole 1: 1(8.75,0)
  round 1.6 hole 1: 2(6.25,0) 3(3.75,0) 4(1.25,0) 5(-1.25,0) 6(-3.75,0) 7(-6.25,0) 8(-8.75,0)
CONN-TH_C4201WR-F-2X4P
  round 3 hole 2: 1(-6.3,2.75) 2(-2.1,2.75) 3(2.1,2.75) 4(6.3,2.75) 5(-6.3,-2.75) 6(-2.1,-2.75) 7(2.1,-2.75) 8(6.3,-2.75)
CONN-TH_XT30PW-M
  round 2.5 hole 1.8: 1(-2.5,5) 2(2.5,5)
  round 1.8 hole 1.1: 3(5.5,-5) 4(-5.5,-5)
DFN-8_L5.5-W5.2-P1.27-LS6.0-BL-EP2
  rect 0.61x1.397 smd: 1(-1.905,-1.66) 2(-0.635,-1.66) 3(0.635,-1.66) 4(1.905,-1.66)
  custom 2.028x4.953 smd: 5(1.3,1.66) 6(-1.3,1.66)
HDR-TH_6P-P2.54-V-F
  rect 1.8x1.6 hole 1.02: 1(-6.35,0)
  round 1.6 hole 1.02: 2(-3.81,0) 3(-1.27,0) 4(1.27,0) 5(3.81,0) 6(6.35,0)
HDR-TH_16P-P2.54-V-F-R2-C8-S2.54-1
  rect 1.8x1.8 hole 1.1: 1(-8.89,-1.27)
  round 1.8 hole 1.1: 2(-8.89,1.27) 3(-6.35,-1.27) 4(-6.35,1.27) 5(-3.81,-1.27) 6(-3.81,1.27) 7(-1.27,-1.27) 8(-1.27,1.27) 9(1.27,-1.27) 10(1.27,1.27) 11(3.81,-1.27) 12(3.81,1.27) 13(6.35,-1.27) 14(6.35,1.27) 15(8.89,-1.27) 16(8.89,1.27)
HDR-TH_20P-P2.54-V-R2-C10-S2.54
  rect 1.7x1.7 hole 1.1: 1(-11.43,-1.27)
  round 1.7 hole 1.1: 2(-11.43,1.27) 3(-8.89,-1.27) 4(-8.89,1.27) 5(-6.35,-1.27) 6(-6.35,1.27) 7(-3.81,-1.27) 8(-3.81,1.27) 9(-1.27,-1.27) 10(-1.27,1.27) 11(1.27,-1.27) 12(1.27,1.27) 13(3.81,-1.27) 14(3.81,1.27) 15(6.35,-1.27) 16(6.35,1.27) 17(8.89,-1.27) 18(8.89,1.27) 19(11.43,-1.27) 20(11.43,1.27)
HTSSOP-48_L12.5-W6.1-P0.50-LS8.1-BL-EP4.4
  rect 0.3x1.55 smd: 1(-5.75,-3.8) 2(-5.25,-3.8) 3(-4.75,-3.8) 4(-4.25,-3.8) 5(-3.75,-3.8) 6(-3.25,-3.8) 7(-2.75,-3.8) 8(-2.25,-3.8) 9(-1.75,-3.8) 10(-1.25,-3.8) 11(-0.75,-3.8) 12(-0.25,-3.8) 13(0.25,-3.8) 14(0.75,-3.8) 15(1.25,-3.8) 16(1.75,-3.8) 17(2.25,-3.8) 18(2.75,-3.8) 19(3.25,-3.8) 20(3.75,-3.8) 21(4.25,-3.8) 22(4.75,-3.8) 23(5.25,-3.8) 24(5.75,-3.8) 25(5.75,3.8) 26(5.25,3.8) 27(4.75,3.8) 28(4.25,3.8) 29(3.75,3.8) 30(3.25,3.8) 31(2.75,3.8) 32(2.25,3.8) 33(1.75,3.8) 34(1.25,3.8) 35(0.75,3.8) 36(0.25,3.8) 37(-0.25,3.8) 38(-0.75,3.8) 39(-1.25,3.8) 40(-1.75,3.8) 41(-2.25,3.8) 42(-2.75,3.8) 43(-3.25,3.8) 44(-3.75,3.8) 45(-4.25,3.8) 46(-4.75,3.8) 47(-5.25,3.8) 48(-5.75,3.8)
  rect 4.4x3.5 smd: 49(0,0)
LED0805-R-RD
  rect 1x1.399 smd: 1(1.05,0) 2(-1.05,0)
LED_0805
  rect 1x1.25 smd: 1(-1.15,0.005) 2(1.05,0.005)
R0603
  rect 0.806x0.864 smd: 1(-0.753,0) 2(0.753,0)
R0805
  rect 1.133x1.377 smd: 1(-1,0) 2(1,0)
SOD-123_L2.7-W1.6-LS3.7-RD
  rect 0.91x1.22 smd: 1(-1.635,0) 2(1.635,0)
SOT-89-3_L4.5-W2.5-P1.50-LS4.2-BR
  rect 1.575x0.672 smd: 1(1.356,-1.5) 3(1.356,1.5)
  custom 5.377x1.9 smd: 2(-1.356,0)
SOT-223-3_L6.5-W3.4-P2.30-LS7.0-BR
  rect 2.5x1.1 smd: 1(2.97,-2.3) 2(2.97,0) 3(2.97,2.3)
  rect 2.34x3.6 smd: 4(-2.97,0)
SW-TH_SS21-BBIWP2
  round 3 hole 2: 1(-5,2.35) 2(-5,-2.35) 3(5,2.35) 4(5,-2.35)
Test-Point-0.5mm
  round 0.5 smd: 1(0,0)

## Nets
As in the schematic.

Pads without a net: CN1 3 4; H5 16 18 20

## Via types
v1: diameter 0.508, hole 0.305, Top Layer to Bottom Layer, 186 vias
v2: diameter 1.016, hole 0.813, Top Layer to Bottom Layer, 5 vias

## Routing (per net, layer and track width the routed paths; a pad name or vN(x,y) marks a point on that pad's centre or on a via; arc(x,y) is an arc through that point)
16V: length 77.7
  Bottom Layer w0.254: TP2.1 39.01,49.61 38.97,49.65 ; 40.52,54.83 40.52,51.48 C79.2 40.45,49.96 40.13,49.65 38.97,49.65 ; C78.2 C44.2 27.02,33.68 27.16,33.53 ; 38.97,49.65 33.78,49.65 33.56,49.87 D6.1
  Bottom Layer w0.508: 42.04,54.83 42.04,52.69 42.8,51.93 43.56,51.93 44.32,51.17 44.32,41.39 45.34,40.38 45.34,36.69 44.7,36.06 36.83,36.06 36.07,35.3 36.07,34.79 35.31,34.03 27.66,34.03 27.16,33.53
  Bottom Layer w0.762: 40.52,54.83 43.29,54.83 44.7,56.25 44.7,58.65 SW1.4 SW1.3
+5V: length 117.1
  Top Layer w0.762: H6.1 H6.3 H6.5 H6.7
  Bottom Layer w0.254: C26.2 C25.2 9.99,30.77 10.29,30.47 12.31,30.47 U3.3 ; 27.16,30.53 27.16,28.3 C45.2 C46.2 27.02,24.15 27.18,23.99 30.35,23.99 30.73,24.37 30.73,25.62 TP1.1
  Bottom Layer w0.508: 22.35,30.53 37.15,30.53 37.85,29.84 37.85,19.93 38.23,19.55 49.15,19.55 50.67,18.02 50.67,10.02 51.69,9.01 56.9,9.01 H6.7 ; 22.35,30.53 22.35,12.06 20.43,10.14 U8.1 ; 22.35,30.53 12.6,30.6 U3.3
AGND: length 2.5
  Top Layer w0.254: v1(17.02,46.47) 17.27,46.47 17.4,46.6 18.37,46.6 18.41,46.63 18.41,45.63
  vias: v1(3.35,35.68) v1(3.35,34.92) v1(3.48,30.22) v1(3.48,29.45) v1(3.48,27.8) v1(3.48,27.04) v1(4.06,35.68) v1(4.06,34.92) v1(4.19,30.22) v1(4.19,29.45) v1(4.19,27.8) v1(4.19,27.04) v1(9.95,59.43) v1(9.95,58.66) v1(10.08,62.47) v1(10.08,61.71) v1(10.67,59.43) v1(10.67,58.66) v1(10.72,3.8) v1(10.72,3.04) v1(10.79,62.47) v1(10.79,61.71) v1(11.43,3.8) v1(11.43,3.04) v1(15.42,3.67) v1(15.42,2.91) v1(16.13,3.67) v1(16.13,2.91) v1(17.45,38.34) v1(17.45,37.58) v1(17.57,41.01) v1(17.57,40.25) v1(18.16,38.34) v1(18.16,37.58) v1(18.29,41.01) v1(18.29,40.25) v1(19.73,12.94) v1(19.73,12.18) v1(20.11,62.6) v1(20.11,61.84) v1(20.45,12.94) v1(20.45,12.18) v1(20.83,62.6) v1(20.83,61.84) v1(24.69,12.82) v1(24.69,12.06) v1(25.4,12.82) v1(25.4,12.06) v1(26.85,6.85) v1(26.85,6.09) v1(27.56,6.85) v1(27.56,6.09) v1(32.31,4.31) v1(32.31,3.55) v1(33.02,4.31) v1(33.02,3.55) v1(37.26,62.86) v1(37.26,62.09) v1(37.97,62.86) v1(37.97,62.09) v1(39.16,62.86) v1(39.16,62.09) v1(39.88,62.86) v1(39.88,62.09) v1(40.94,62.86) v1(40.94,62.09) v1(41.66,62.86) v1(41.66,62.09) v1(43.36,62.86) v1(43.36,62.09) v1(44.07,62.86) v1(44.07,62.09) v1(45.13,4.44) v1(45.13,3.67) v1(45.85,4.44) v1(45.85,3.67) v1(48.31,57.39) v1(48.31,56.63) v1(48.31,55.24) v1(48.31,54.47) v1(49.02,57.39) v1(49.02,56.63) v1(49.02,55.24) v1(49.02,54.47) v1(49.07,4.44) v1(49.07,3.67) v1(49.78,4.44) v1(49.78,3.67) v1(50.59,55.24) v1(50.59,54.47) v1(50.82,57.39) v1(50.82,56.63) v1(50.85,47.62) v1(50.85,46.85) v1(51.31,55.24) v1(51.31,54.47) v1(51.54,57.39) v1(51.54,56.63) v1(51.48,6.85) v1(51.48,6.09) v1(51.48,4.31) v1(51.48,3.55) v1(51.56,47.62) v1(51.56,46.85) v1(52.2,6.85) v1(52.2,6.09) v1(52.2,4.31) v1(52.2,3.55) v1(53.01,16.63) v1(53.01,15.87) v1(53.26,13.96) v1(53.26,13.2) v1(53.39,11.04) v1(53.39,10.28) v1(53.72,16.63) v1(53.72,15.87) v1(53.97,13.96) v1(53.97,13.2) v1(54.1,11.04) v1(54.1,10.28) v1(56.44,26.79) v1(56.44,26.03) v1(57.15,26.79) v1(57.15,26.03) v1(57.56,61.84) v1(57.56,61.08) v1(57.56,55.62) v1(57.56,54.85) v1(57.68,58.41) v1(57.68,57.65) v1(57.68,53.2) v1(57.68,52.44) v1(58.27,61.84) v1(58.27,61.08) v1(58.27,55.62) v1(58.27,54.85) v1(58.4,58.41) v1(58.4,57.65) v1(58.4,53.2) v1(58.4,52.44)
PVDD: length 244.3
  Top Layer w0.254: Q3.6 33.6,23.79 34.34,23.05 C81.2 ; C82.2 18.67,22.81 18.67,24.88 18.39,25.16 Q2.6 ; Q1.6 53.78,22.9 C80.2 ; 18.41,57.13 18.41,57.14 18.41,60.19 18.72,60.49 C58.1 29.37,60.49 C57.1 29.54,60.57 42.54,60.57 42.8,60.32 42.8,30.85 42.43,30.49 37.59,30.49
  Top Layer w0.762: Q2.6 14.54,22.28 15.11,21.71 v2(16.64,21.71) ; v2(36.07,37.33) 37.59,35.8 37.59,29.22 Q3.6 34.67,21.28 v2(34.67,21.07) ; v2(53.97,19.29) 50.93,19.29 50.62,19.6 Q1.6
  Inner1 w0.762: v2(53.97,19.29) 52.2,21.07 47.97,21.07 ; v2(16.64,21.71) 34.04,21.71 v2(34.67,21.07) 47.97,21.07 ; 47.97,21.07 48.01,21.04 48.01,6.98 47.37,6.34 32.64,6.34 31.94,7.04 U5.3
  Bottom Layer w0.254: 20.3,45.71 20.3,45.84 20.55,46.09 31.53,46.09 ; 20.3,45.71 9.32,45.71 9.06,45.46 C75.1 ; 20.3,45.71 C76.1 ; C68.2 39.33,47.36 31.75,47.36 31.53,47.14 31.53,46.09 ; R66.2 32.33,39.03 31.53,39.83 C77.1 31.53,46.09
  Bottom Layer w0.762: C76.1 20.3,41.03 20.96,40.38 29.15,40.38 32.2,37.33 v2(36.07,37.33)
PVDDSENSE: length 9.7
  Bottom Layer w0.254: R66.1 36.25,39.03 36.32,39.11 38.29,39.11 38.29,38.03 38.48,37.84 42.16,37.84 42.29,37.96 42.29,39.22 R67.2
VCC: length 109.8
  Top Layer w0.254: 18.41,47.13 18.38,47.11 15.62,47.11 15.49,46.98 R42.2 R43.2 12.91,44.19 11.94,44.19 11.81,44.06 11.81,42.41 11.56,42.15 v1(10.41,42.15)
  Top Layer w0.762: H6.15 H6.13 H6.11 H6.9
  Inner4 w0.762: v2(20.45,25.14) 21.46,24.12 56.39,24.12 57.15,23.36 H6.15
  Bottom Layer w0.254: 9.99,26.91 7.87,26.91 7.62,27.17 7.62,41.77 8,42.15 v1(10.41,42.15) ; 9.99,26.91 9.99,27.76 10.29,28.06 12.36,28.06 ; 9.99,26.91 C27.2 C28.2 9.99,17.56 10.29,17.26 13.88,17.26 14.31,16.83
  Bottom Layer w0.762: 12.36,28.06 U3.2 U3.4 20.03,28.09 20.45,27.68 v2(20.45,25.14)
ASENSE: length 4.2
  Top Layer w0.254: R51.2 42.89,26.35 C60.2 R50.1
BSENSE: length 5
  Top Layer w0.254: R57.2 24.99,29.91 C63.2 24.99,27.78 R56.1
CSENSE: length 5.5
  Top Layer w0.254: 5.49,31.93 7.61,31.93 C66.2 7.72,28.86 R59.1
DC_CAL: length 24.9
  Top Layer w0.254: U7.8 25.03,49.13 v1(24.64,49.52)
  Inner2 w0.254: H5.13 4.96,52.57 20.45,52.57 20.7,52.31 20.7,49.77 20.96,49.52 v1(24.64,49.52)
EN_GATE: length 26.6
  Top Layer w0.254: v1(24.64,50.66) 25.11,51.13 U7.12
  Inner2 w0.254: v1(24.64,50.66) 21.84,50.66 21.46,51.04 21.46,53.33 20.64,54.16 18.48,54.16 18.03,53.71 6.48,53.71 5.97,54.22 5.97,55.62 5.72,55.87 4.45,55.87 H5.15
GH_A: length 53.5
  Top Layer w0.254: R48.1 51.05,30.06 v1(51.05,31.61) ; 18.41,48.13 19.68,48.13 v1(19.81,48)
  Inner1 w0.254: v1(51.05,31.61) 51.05,34.79 50.8,35.04 48.26,35.04 47.12,36.19 44.7,36.19 44.45,35.93 44.45,34.28 44.32,34.15 24.13,34.15 24,34.28 24,35.8 23.62,36.19 20.19,36.19 19.43,36.95 19.43,47.62 v1(19.81,48)
GH_B: length 47.5
  Top Layer w0.254: 18.41,50.63 19.46,50.63 v1(19.81,50.28) ; v1(36.19,32.38) 36.11,32.29 R54.1
  Inner1 w0.254: v1(36.19,32.38) 15.37,32.38 15.11,32.63 15.11,50.28 v1(19.81,50.28)
GH_C: length 30
  Top Layer w0.254: v1(19.81,53.2) 19.74,53.13 18.41,53.13 ; v1(12.57,34.15) 15.01,34.15 R61.1
  Inner1 w0.254: v1(12.57,34.15) 12.57,52.57 13.21,53.2 v1(19.81,53.2)
GL_A: length 73.9
  Top Layer w0.254: 18.41,49.13 19.3,49.13 v1(19.69,49.52) ; v1(43.94,30.34) 44.47,29.82 R49.1
  Inner1 w0.254: v1(19.69,49.52) 20.19,49.52 20.7,49.01 20.7,37.07 20.96,36.82 24.51,36.82 24.76,36.57 24.76,35.17 25.02,34.92 43.05,34.92 43.31,35.17 43.31,38.6 43.69,38.98 52.83,38.98 53.21,38.6 53.21,29.71 52.83,29.33 44.07,29.33 43.94,29.45 v1(43.94,30.34)
GL_B: length 44.7
  Top Layer w0.254: v1(26.42,29.71) 26.42,31.87 26.92,32.38 28.19,32.38 R55.1 ; 18.41,51.63 19.51,51.63 v1(19.81,51.93)
  Inner1 w0.254: v1(19.81,51.93) 19.18,51.3 14.48,51.3 13.97,50.79 13.97,31.11 15.37,29.71 v1(26.42,29.71)
GL_C: length 27.2
  Top Layer w0.254: v1(15.75,54.35) 15.96,54.13 18.41,54.13 ; R62.1 11.18,34.21 v1(11.18,35.42)
  Inner1 w0.254: v1(15.75,54.35) 11.68,54.35 11.18,53.84 v1(11.18,35.42)
H1: length 26.6
  Bottom Layer w0.254: U8.2 17.93,13.81 17.4,14.34 9.53,14.34 8.89,14.98 8.89,16.75 8.51,17.14 H7.4
H2: length 21.7
  Bottom Layer w0.254: H7.5 7.62,14.6 8.76,13.45 15.24,13.45 15.49,13.2 15.49,6.53 U8.3
H3: length 17.2
  Bottom Layer w0.254: U8.4 12.93,11.82 12.7,12.06 H7.6
HAL1: length 57.5
  Inner1 w0.254: H7.1 5.59,24.76 5.84,24.5 5.84,20.82 6.22,20.44 33.53,20.44 34.04,19.93 35.31,19.93 35.69,19.55 42.29,19.55 42.8,19.04 42.8,10.28 42.54,10.02 40.42,10.02 U5.1
HAL2: length 44.5
  Inner1 w0.254: U5.2 34.16,11.91 34.16,18.28 33.02,19.42 5.59,19.42 4.7,20.31 4.7,21.58 4.06,22.22 H7.2
HAL3: length 43.3
  Inner4 w0.254: H7.3 40,19.68 40.39,19.29 40.39,15.49 U5.5
INH_A: length 30.8
  Top Layer w0.254: U7.13 27.51,51.63 v1(27.56,51.68)
  Inner2 w0.254: H5.17 6.48,58.28 6.86,57.9 6.86,56.51 7.11,56.25 21.46,56.25 22.1,55.62 22.1,51.93 22.48,51.55 24,51.55 24.26,51.3 27.18,51.3 v1(27.56,51.68)
INH_B: length 51.7
  Top Layer w0.254: v1(32.13,51.04) 31.34,51.04 31.22,51.17 31.22,51.75 30.77,52.19 28.07,52.19 27.62,52.63 U7.15
  Inner3 w0.254: H5.2 3.05,36.69 31.12,36.69 31.5,37.07 31.5,50.41 v1(32.13,51.04)
INH_C: length 41.1
  Top Layer w0.254: v1(27.43,53.71) 27.35,53.63 U7.17
  Inner2 w0.254: v1(27.43,53.71) 28.45,52.7 28.45,42.79 27.69,42.03 11.68,42.03 11.05,41.39 5.72,41.39 5.33,41.77 2.41,41.77 1.78,42.4 H5.6
INL_A: length 29.6
  Top Layer w0.254: U7.14 24.84,52.13 v1(24.64,51.93)
  Inner2 w0.254: v1(24.64,51.93) 24.64,52.06 24,52.7 23.62,52.7 23.37,52.95 23.37,57.39 23.11,57.65 8.64,57.65 8.38,57.9 8.38,60.44 8,60.82 4.33,60.82 H5.19
INL_B: length 52.1
  Top Layer w0.254: U7.16 25.1,53.13 24.91,53.33 v1(24.51,53.33)
  Inner2 w0.254: H5.4 2.92,39.36 29.59,39.36 30.35,40.12 30.35,54.09 29.59,54.85 26.16,54.85 25.78,54.47 25.78,53.71 25.4,53.33 v1(24.51,53.33)
INL_C: length 34
  Top Layer w0.254: U7.18 24.72,54.13 v1(24.51,54.35)
  Inner3 w0.254: H5.8 2.92,44.44 9.78,44.44 10.03,44.69 10.03,53.46 10.29,53.71 18.8,53.71 19.18,54.09 24.26,54.09 v1(24.51,54.35)
NFAULT: length 26.8
  Top Layer w0.254: U7.2 24.04,46.13 23.88,45.96 23.88,43.55 23.75,43.42 14.6,43.42 14.35,43.17 14.35,42.92 14.16,42.72 12.95,42.72 12.95,40.62 12.83,40.5 4.33,40.5 H5.3
NOCTW: length 28.5
  Top Layer w0.254: U7.1 25.91,45.53 25.91,42.92 25.71,42.72 15.49,42.72 15.49,40 14.99,39.49 6.22,39.49 5.97,39.23 5.97,38.34 5.58,37.96 H5.1
NSCS: length 25.5
  Top Layer w0.254: U7.4 25.1,47.13 24.82,46.85 v1(24.38,46.85)
  Inner2 w0.254: H5.5 4.33,43.04 24.13,43.04 24.38,43.29 v1(24.38,46.85)
REF: length 32.9
  Top Layer w0.254: v1(24.51,55.24) 25,55.24 25.1,55.13 U7.20
  Inner3 w0.254: H5.10 2.29,47.62 2.29,47.11 2.54,46.85 6.48,46.85 6.86,47.23 6.86,54.6 7.24,54.98 24.26,54.98 v1(24.51,55.24)
SCLK: length 25.8
  Top Layer w0.254: U7.7 27.18,48.63 v1(27.43,48.89)
  Inner3 w0.254: v1(11.81,49.52) 12.45,48.89 v1(27.43,48.89)
  Inner4 w0.254: H5.11 11.43,50.66 11.68,50.41 11.68,49.65 v1(11.81,49.52)
SDI: length 25.8
  Top Layer w0.254: v1(27.31,47.62) 27.29,47.63 U7.5
  Inner2 w0.254: v1(27.31,47.62) 27.08,47.39 6.25,47.39 5.97,47.11 5.97,45.96 5.72,45.71 4.45,45.71 H5.7
SDO: length 22.1
  Top Layer w0.254: U7.6 26,48.12 v1(24.38,48.12)
  Inner2 w0.254: v1(24.38,48.12) 23.85,48.66 4.86,48.66 H5.9
SH_A: length 135.2
  Top Layer w0.254: v1(24.51,38.73) 38.99,38.73 39.37,38.34 v1(39.37,32.12) ; 51.23,26.22 51.18,26.17 51.18,25.26 51.05,25.14 48.26,25.14 48.02,24.9 Q1.5 47.88,23.04 R50.2 42.88,22.98 v1(41.4,22.98) ; C54.1 13.03,48.94 13.34,48.63 18.41,48.63 ; v1(21.84,48.12) 21.84,48.63 21.72,48.76 19.81,48.76 19.69,48.63 18.41,48.63 ; 18.41,48.63 18.41,48.63
  Top Layer w1.016: Q1.5 48.02,18.55 47.5,18.02 32.51,18.02 31.94,17.45 U5.7
  Inner1 w0.254: v1(39.37,32.12) 40.77,32.12 41.4,31.49 v1(41.4,22.98) ; v1(21.84,48.12) 21.84,38.98 22.1,38.73 v1(24.51,38.73)
  Inner1 w1.016: U8.8 2.93,17.15 3.94,18.15 29.22,18.15 U5.7
SH_B: length 101.8
  Top Layer w0.254: v1(19.81,51.17) 19.77,51.13 11.72,51.13 11.43,51.43 11.43,53.2 11.2,53.44 C55.1 ; v1(23.88,41.39) 23.75,41.27 21.08,41.27 20.57,40.76 20.57,26.91 21.32,26.17 R56.2 24.89,24.12 25.27,23.74 29.51,23.74 Q3.5 29.59,23.82 29.59,25.9 29.72,26.03 32.51,26.03 32.77,26.28 Q3.1
  Top Layer w1.016: U5.8 27.74,18.58 28.19,19.04 29.08,19.04 29.59,19.55 29.59,23.76 Q3.5
  Inner1 w0.254: v1(23.88,41.39) 23.88,42.66 22.86,43.68 22.86,50.92 22.61,51.17 v1(19.81,51.17)
  Inner1 w1.016: U5.8 27.65,15.36 6.86,15.36 5.43,13.93 U8.7
SH_C: length 101.8
  Top Layer w0.254: v1(9.4,26.15) 9.4,26.91 9.03,27.29 R59.2 7.65,25.49 7.98,25.16 11.92,25.16 ; Q2.1 15.15,27.71 14.86,27.42 12.19,27.42 11.92,27.15 11.92,25.16 ; Q2.5 11.93,25.17 11.92,25.16 ; v1(10.79,57.01) 12.7,57.01 12.95,56.76 12.95,54.21 C56.1 14.37,54.2 15.01,53.56 18.34,53.56 18.41,53.63
  Top Layer w1.016: U5.4 27.56,9.77 12.7,9.77 11.94,10.53 11.94,16.27 ; U8.6 7.93,15.67 8.51,16.25 11.92,16.25 11.94,16.27 ; Q2.5 11.94,16.27
  Inner1 w0.254: v1(9.4,26.15) 9.4,56.38 10.03,57.01 v1(10.79,57.01)
SL_A: length 51.7
  Top Layer w0.254: 18.41,49.63 16.37,49.63 v1(16.26,49.52) ; v1(45.59,35.3) 46.86,35.3 46.99,35.17 46.99,33.82 R65.1
  Inner1 w0.254: v1(16.26,49.52) 16.26,36.06 16.89,35.42 22.99,35.42 23.24,35.17 23.24,33.52 23.5,33.26 45.09,33.26 45.59,33.77 v1(45.59,35.3)
SL_B: length 31
  Top Layer w0.254: v1(16.76,51.93) 17.31,51.93 17.5,52.13 18.41,52.13 ; R64.1 29.79,37.28 v1(30.35,37.84)
  Inner1 w0.254: v1(30.35,37.84) 29.72,38.47 29.72,52.31 29.46,52.57 17.4,52.57 v1(16.76,51.93)
SL_C: length 4.6
  Top Layer w0.254: 18.41,54.63 16.86,54.63 16.76,54.73 16.76,54.98 16.64,55.11 14.87,55.11 14.36,55.62
SN1: length 84
  Top Layer w0.254: 49.66,29.2 49.66,28.69 49.4,28.44 48.76,28.44 R47.2 ; 49.66,29.2 52.83,29.2 53.09,29.45 53.09,30.6 53.34,30.85 54.58,30.85 C59.2 54.61,31.01 v1(54.61,33.26) ; 49.66,29.2 49.66,31.99 49.34,32.31 R65.2 ; v1(20.32,55.62) 19.84,55.13 18.41,55.13
  Top Layer w0.508: R47.2 48.63,26.28 48.69,26.22
  Inner1 w0.254: v1(20.32,55.62) 19.56,55.62 18.8,56.38 18.8,57.9 19.3,58.41 53.21,58.41 54.1,57.52 54.1,33.77 v1(54.61,33.26)
SN2: length 73
  Top Layer w0.254: v1(19.69,56.89) 19.69,56.25 19.57,56.13 18.41,56.13 ; R53.2 30.18,30.72 32.38,30.72 32.53,30.87 C62.2 29.8,35.3 R64.2 27.64,37.46 v1(25.15,37.46)
  Top Layer w0.508: Q3.3 30.17,27.16 R53.2
  Inner1 w0.254: v1(19.69,56.89) 37.08,56.89 37.97,56 37.97,36.69 37.47,36.19 26.66,35.94 26.29,36.31 26.29,37.2 25.91,37.58 25.27,37.58 v1(25.15,37.46)
SO1: length 59.7
  Top Layer w0.254: v1(34.8,51.3) 34.83,51.33 R45.2
  Inner2 w0.254: H5.12 2.54,50.66 3.17,51.3 3.17,63.62 3.43,63.87 34.42,63.87 34.8,63.49 v1(34.8,51.3)
SO2: length 52.1
  Top Layer w0.254: v1(32.51,49.27) 32.54,49.24 C50.2 35.4,47.43 C51.2 35.59,47.62 36.83,47.62 37.11,47.9 R46.2
  Inner3 w0.254: v1(32.51,49.27) 33.02,49.77 33.02,56 32.77,56.25 5.97,56.25 5.72,56 5.72,54.73 5.46,54.47 2.79,54.47 2.67,54.35 2.67,54.08 H5.14
SP1: length 8
  Top Layer w0.254: 18.41,55.63 15.6,55.63 15.37,55.87 15.37,57.65 15.11,57.9 13.72,57.9 13.72,57.91 13.59,58.03 13.59,59.18
SP2: length 4.8
  Top Layer w0.254: U7.26 16.26,56.63 16.01,56.88 16.01,59.18
$3N286: length 2.8
  Bottom Layer w0.254: R10.1 16.52,16.84 16.51,16.83
$3N603: length 14.4
  Bottom Layer w1.016: SW1.1 SW1.2 47.05,48.95 47.75,48.25 47.88,48.25 48.77,47.36 48.77,42.19 CN1.1
$3N605: length 3.8
  Bottom Layer w0.254: LED2.1 38.57,56.79 39.01,56.36 R41.1
$3N1469: length 6.7
  Top Layer w0.254: R44.1 28.46,42.9 28.19,43.17 28.19,46.35 27.94,46.6 26.04,46.6 U7.3
$3N1546: length 5.5
  Top Layer w0.254: U7.9 26.02,49.65 28.45,49.65 28.7,49.39 28.7,49.01 28.83,48.89 29.46,48.89 29.57,48.78 C48.2
$3N1634: length 4.1
  Top Layer w0.254: U7.10 26.03,50.16 29.65,50.16 C49.1
$3N1637: length 4.2
  Top Layer w0.254: U7.11 27.78,50.63 28.07,50.92 29.65,50.92 C49.2
$3N1642: length 10.8
  Top Layer w0.254: U7.21 26.02,55.62 28.57,55.62 28.7,55.49 28.7,53.97 28.96,53.71 34.16,53.71 34.16,53.76 34.83,54.42
$3N1645: length 12.6
  Top Layer w0.254: 37.11,54.42 37.08,54.45 37.08,55.87 36.82,56.13 U7.22
$3N1837: length 5.8
  Top Layer w0.254: U7.23 30.23,56.63 30.48,56.89 30.48,58.1 C52.1
$3N1907: length 7.5
  Top Layer w0.254: U7.19 27.78,54.63 28.19,54.22 28.19,53.08 28.45,52.82 31.91,52.82 C53.1
$3N2117: length 10.3
  Top Layer w0.254: 18.41,47.63 18.39,47.62 13.46,47.62 12.78,46.94 C54.2
$3N2227: length 5.6
  Top Layer w0.254: C56.2 14.74,52.2 15.18,52.63 18.41,52.63
$3N2233: length 10.9
  Top Layer w0.254: C55.2 10.27,51.44 10.67,51.04 10.67,50.41 10.92,50.16 18.38,50.16 18.41,50.13
$4N615: length 3.2
  Top Layer w0.254: R48.2 50.92,28.31 50.16,28.31 49.96,28.11 49.96,26.22
$4N618: length 3.8
  Top Layer w0.254: R49.2 47.24,28.31 47.37,28.18 47.37,26.27 47.42,26.22
$4N1413: length 5.8
  Top Layer w0.254: R54.2 33.78,30.77 33.78,29.2 33.66,29.07 31.62,29.07 31.5,28.95 Q3.2
$4N1415: length 4.2
  Top Layer w0.254: R55.2 28.21,28.81 28.45,28.57 28.7,28.57 28.96,28.31 28.96,27.11 Q3.4
$4N1749: length 5.5
  Top Layer w0.254: R61.2 14.13,32.79 13.84,32.5 13.84,28.52 Q2.2
$4N1755: length 4.3
  Top Layer w0.254: 11.15,32.67 11.15,28.67 Q2.4
$4N2179: length 5.2
  Bottom Layer w0.254: C68.1 41.68,47.12 R68.2

## Copper pours and planes (outline as drawn; the poured copper is in the pictures)
AGND on Top Layer: -3.43,70.35 63.37,70.35 63.37,-1.53 -3.43,-1.53
AGND on Bottom Layer: -0.64,67.81 62.48,67.81 62.48,-0.39 -0.64,-0.39

Small or netless copper shapes (teardrops, artwork), in the pictures only: 220 on Top Layer, 82 on Bottom Layer, 46 on Inner1, 22 on Inner2, 10 on Inner3, 6 on Inner4

## Text on the board
Bottom Silkscreen Layer: VCC | 5V | AGND | 逐梦机甲，畅享绿茵
Top Silkscreen Layer: INH_B | HAL1 | HAL2 | HAL3 | H1 | H2 | H3 | SO2 | SO1 | REF | INL_A | EN_GATE | INL_C | INH_C | INL_B | SDO | SDI | NSCS | NFAULT | NOCTW | INH_A | DC_CAL | SCLK
